# Altium schematic sheet thermokoppel.SchDoc: Soldeerstaion
size A4; DocumentNumber: PXLAI_20230001; SheetNumber: 1; SheetTotal: 5; Number: 2023_02_001; SheetNumber+/+SheetTotal: 1/2; SPICEModelCacheZQDSQXWO: <root> / <DocumentId>ZQDSQXWO</DocumentId> / <CacheFrame Number="0"> / <Model Name="mcp6001" Kind="CKT"> / <Text>.SUBCKT MCP6001 1 2 3 4 5 / *               | | | | | / *               | | | | Output / *               | | | Negative Supply / *               | | Positive Supply / *               | Inverting Input / *               Non-inverting Input / * / ******************************************************************************** / * Software License Agreement                                                   * / *                                                                              * / * The software supplied herewith by Microchip Technology Incorporated (the     * / * "Company") is intended and supplied to you, the Company's customer, for use  * / * soley and exclusively on Microchip products.                                 * / *                                                                              * / * The software is owned by the Company and/or its supplier, and is protected   * / * under applicable copyright laws. All rights are reserved. Any use in         * / * violation of the foregoing restrictions may subject the user to criminal     * / * sanctions under applicable laws, as well as to civil liability for the       * / * breach of the terms and conditions of this license.                          * / *                                                                              * / * THIS SOFTWARE IS PROVIDED IN AN "AS IS" CONDITION. NO WARRANTIES, WHETHER    * / * EXPRESS, IMPLIED OR STATUTORY, INCLUDING, BUT NOT LIMITED TO, IMPLIED        * / * WARRANTIES OF MERCHANTABILITY AND FITNESS FOR A PARTICULAR PURPOSE APPLY TO  * / * THIS SOFTWARE. THE COMPANY SHALL NOT, IN ANY CIRCUMSTANCES, BE LIABLE FOR    * / * SPECIAL, INCIDENTAL OR CONSEQUENTIAL DAMAGES, FOR ANY REASON WHATSOEVER.     * / ******************************************************************************** / * / * Macromodel for the MCP6001/2/4 op amp family: / *   MCP6001, MCP6001R, MCP6001U, MCP6002, MCP6004 / * / * Revision History: / *   REV A: 21-Jun-02, Created model / *   REV B: 16-Jul-02, Improved output stage / *   REV C: 03-Jan-03, Added MCP6001 / *   REV D: 19-Aug-06, Added over temperature, improved output stage, / *                     fixed overdrive recovery time / *   REV E: 27-Jul-07, Updated output impedance for better model stability w/cap load / *   REV F: 09-Jul-12, Added MCP6001R, MCP6001U / * / * Recommendations: / *   Use PSPICE (other simulators may require translation) / *   For a quick, effective design, use a combination of: data sheet / *     specs, bench testing, and simulations with this macromodel / *   For high impedance circuits, set GMIN=100F in .OPTIONS / * / * Supported: / *   Typical performance for temperature range (-40 to 125) degrees Celsius / *   DC, AC, Transient, and Noise analyses. / *   Most specs, including: offsets, DC PSRR, DC CMRR, input impedance, / *     open loop gain, voltage ranges, supply current, ... , etc. / *   Temperature effects for Ibias, Iquiescent, Iout short circuit / *   current, Vsat on both rails, Slew Rate vs. Temp and P.S. / * / * Not Supported: / *   Some Variation in specs vs. Power Supply Voltage / *   Monte Carlo (Vos, Ib), Process variation / *   Distortion (detailed non-linear behavior) / *   Behavior outside normal operating region / * / * Input Stage / V10  3 10 -500M / R10 10 11 6.90K / R11 10 12 6.90K / C11 11 12 0.2p / C12 1  0 6.00P / E12 71 14 POLY(4) 20 0 21 0 26 0 27 0   1.00M 20.1 20.1 1 1 / G12 1 0 62 0 1m / M12 11 14 15 15 NMI L=2.00U W=42.0U / M14 12  2 15 15 NMI L=2.00U W=42.0U / G14 2 0 62 0 1m / C14  2  0 6.00P / I15 15  4 50.0U / V16 16  4 -300M / GD16 16 1 TABLE {V(16,1)} ((-100,-1p)(0,0)(1m,1n)(2m,1m)(3m,1)) / V13  3 13 -300M / GD13 2 13 TABLE {V(2,13)} ((-100,-1p)(0,0)(1m,1n)(2m,1m)(3m,1)) / R70 1 0 20.6T / R71 2 0 20.6T / R72 1 2 20T / I80 1 2 0.5p / * / * Noise, PSRR, and CMRR / I20 21 20 423U / D20 20  0 DN1 / D21  0 21 DN1 / G26  0 26 POLY(1) 3 4   110U -49U / R26 26  0 1 / G27  0 27 POLY(2) 1 0 2 0   -440U 39.7U 39.7U / R27 27  0 1 / * / * Open Loop Gain, Slew Rate / G30  0 30 POLY(1) 12 11   0 1 / R30 30  0 1K / G31  0 31 POLY(1) 3 4 86 5.25 / R31 31  0 1 TC=2.8m / GD31 30 31 TABLE {V(30,31)} ((-11,-1)(-10,-10n)(0,0)(1m,1000)) / G32 32  0 POLY(1) 3 4 113.7 3.5 / R32 32  0 1 TC=2.65m / GD32 30 32 TABLE {V(30,32)} ((-1m,-1000)(0,0)(10,10n)(11,1)) / G33 0 33 30 0 1m / R33 33 0 1k / G34  0 34 33 0 425M / R34  34 0 1K / C34  34 0 74U / G37  0 37 34 0 1m / R37  37 0 1K / C37  37 0 41.6P / G38  0 38 37 0 1m / R38  39 0 1K / L38  38 39 100U / E38  35 0 38 0 1 / G35 33 0 TABLE {V(35,3)} ((-1,-1n)(0,0)(16,1n))(16.1,1)) / G36 33 0 TABLE {V(35,4)} ((-16.1,-1)((-16,-1n)(0,0)(1,1n)) / * / * Output Stage / R80 50 0 100MEG / G50 0 50 57 96 2 / R58 57  96 0.50 / R57 57  0 750 / C58  5  0 2.00P / G57  0 57 POLY(3) 3 0 4 0 35 0   0 0.67M 0.67M 1.5M / GD55 55 57 TABLE {V(55,57)} ((-2m,-1)(-1m,-1m)(0,0)(10,1n)) / GD56 57 56 TABLE {V(57,56)} ((-2m,-1)(-1m,-1m)(0,0)(10,1n)) / E55 55  0 POLY(2) 3 0 51 0 -0.7m 1 -40.0M / E56 56  0 POLY(2) 4 0 52 0 1.2m 1 -37.0M / R51 51 0 1k / R52 52 0 1k / GD51 50 51 TABLE {V(50,51)} ((-10,-1n)(0,0)(1m,1m)(2m,1)) / GD52 50 52 TABLE {V(50,52)} ((-2m,-1)(-1m,-1m)(0,0)(10,1n)) / G53  3  0 POLY(1) 51 0  -49U 1M / G54  0  4 POLY(1) 52 0  -49U -1M / * / * Current Limit / G99 96 5 99 0 1 / R98 0 98 1 TC=-2.8M,2.63U / G97 0 98 TABLE { V(96,5) } ((-11.0,-10.0M)(-1.00M,-9.9M)(0,0)(1.00M,9.9M)(11.0,10.0M)) / E97 99 0 VALUE { V(98)*((V(3)-V(4))*359M + 310M)} / D98 4 5 DESD / D99 5 3 DESD / * / * Temperature / Voltage Sensitive IQuiscent / R61 0 61 100 TC 3.11M 4.51U / G61 3 4 61 0 1 / G60 0 61 TABLE {V(3, 4)} / + ((0,0)(900M,0.0106U)(1.00,0.20U)(1.3,0.63U) / + (1.5,0.66U)(1.6,1.06U)(5.5,1.10U)) / * / * Temp Sensitive offset voltage / I73 0 70 DC 1uA / R74 0 70 1 TC=2 / E75 1 71 70 0 1 / * / * Temp Sensistive IBias / I62 0 62 DC 1uA / R62 0 62 REXP 58.2u / * Voltage on R62 used for G12, G14 in input stage / * / * Models / .MODEL NMI NMOS / .MODEL DESD  D   N=1 IS=1.00E-15 / .MODEL DL  D   N=1 IS=1F / .MODEL DN1 D   IS=1P KF=146E-18 AF=1 / .MODEL REXP RES TCE=10.1 / .ENDS MCP6001</Text> / </Model> / </CacheFrame> / </root>
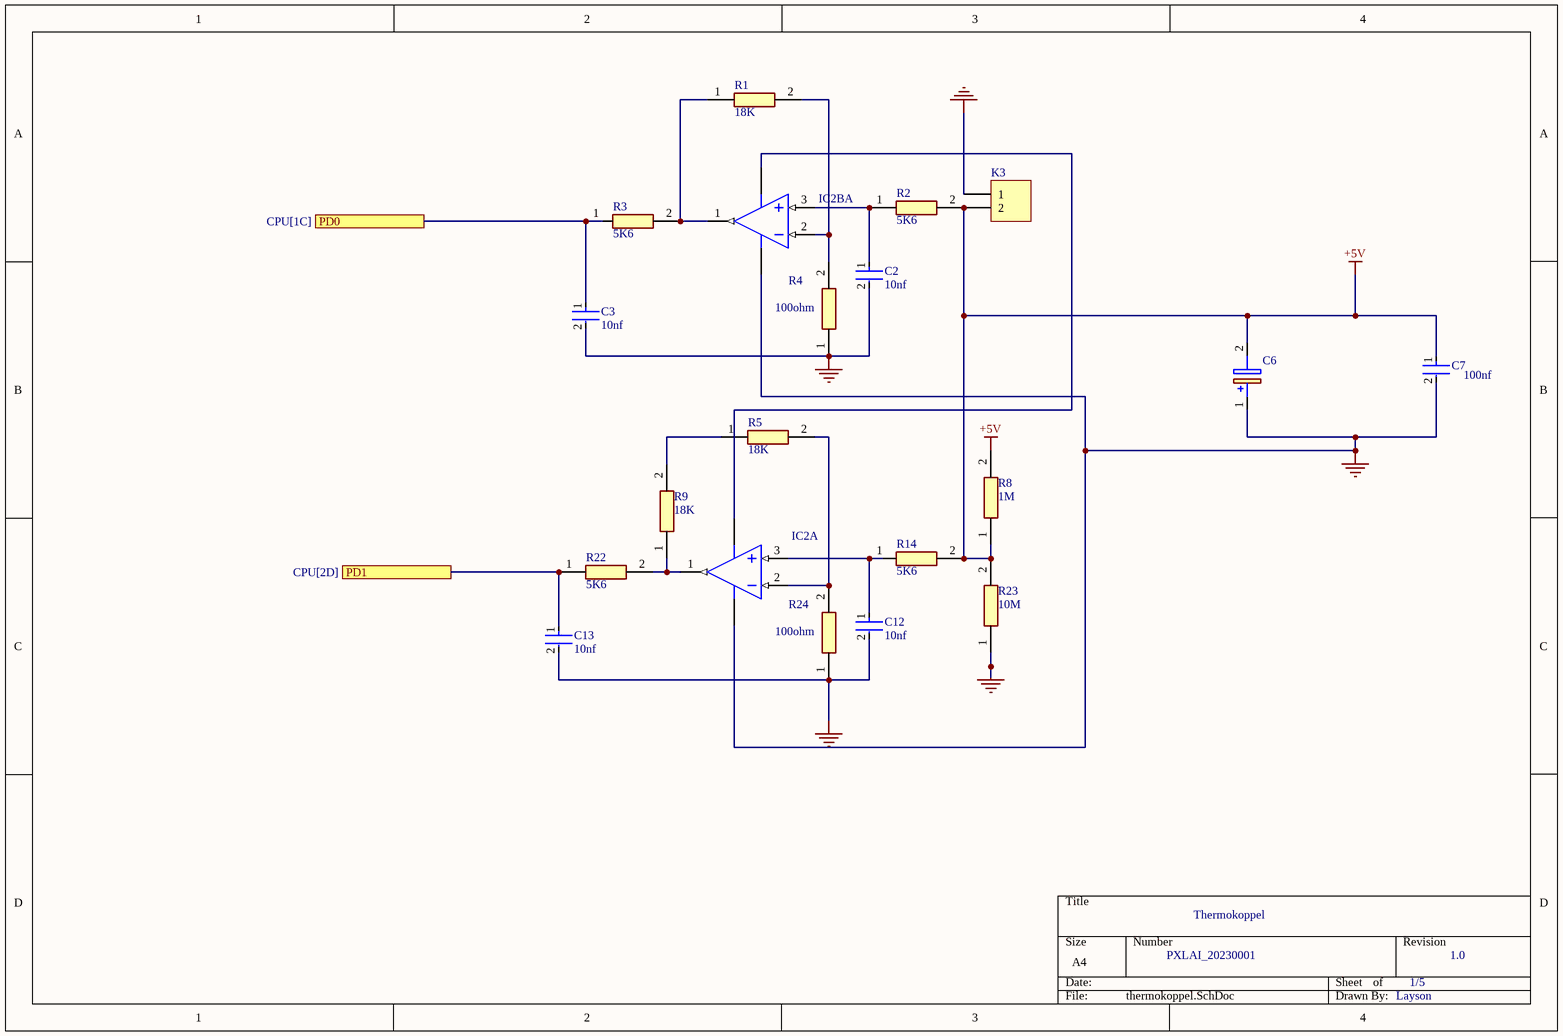
[diagram p0: thermokoppel.SchDoc]

## Parts
C2  10nf  [FP-RDE0M1-MFG]
C3  10nf  [FP-RDE0M1-MFG]
C6  MCGPR50V106M5X11  [CAPPRD200W52D525H1200]  (value not drawn)
C7  100nf  [FP-C0402-BB-MFG]
C12  10nf  [FP-RDE0M1-MFG]
C13  10nf  [FP-RDE0M1-MFG]
IC2  IC2A  [SOIC-SN8_M]  (value not drawn)  (part A of 2)
IC2B  MCP6002-E/MS  [MSOP-MS8_M]  (value not drawn)  (part A of 2)
K3  Header 2  [HDR1X2]  (value not drawn)
R1  18K  [RESC2012X65N]
R2  5K6  [RESC2012X65N]
R3  5K6  [RESC2012X65N]
R4  100ohm  [RESC2012X60N]
R5  18K  [RESC2012X65N]
R8  1M  [RESC2012X65N]
R9  18K  [RESC2012X65N]
R14  5K6  [RESC2012X65N]
R22  5K6  [RESC2012X65N]
R23  10M  [RESC2013X65N]
R24  100ohm  [RESC2012X60N]

## Ports
PD0 (see CPU[1C]), PD1 (see CPU[2D])

## Nets
+5V: C6.2(-) C7.1 K3.2 R2.2 R8.1 R8.2 R14.2 R23.2
GND: C2.2 C3.2 C6.1(+) C7.2 C12.2 C13.2 IC2.8(VDD) IC2B.8(VDD) K3.1 R4.1 R23.1 R24.1
PD0: C3.1 R3.1 ; port PD0
PD1: C13.1 R22.1 ; port PD1
NetC2_1: C2.1 IC2B.3(VINA+) R2.1
NetC12_1: C12.1 IC2.3(VINA+) R14.1
NetIC2_1: IC2.1(VOUTA) R9.1 R22.2
NetIC2_2: IC2.2(VINA-) R5.2 R24.2
NetIC2_4: IC2.4(VSS) IC2B.4(VSS)
NetIC2B_1: IC2B.1(VOUTA) R1.1 R3.2
NetIC2B_2: IC2B.2(VINA-) R1.2 R4.2
NetR5_1: R5.1 R9.2

## Notes on the sheet
- Thermokoppel
- PXLAI_20230001
- 1/5
- 1.0
- Layson

## Library data of the parts
C2 C3 C12 C13 = CMP-06035-022384-1: Ceramic Capacitor 10nF ±10% 50V X7R Radial; Lead Diameter: 0.5mm; Lead/Base Style: Kinked; Packaging: Tape and Reel; Min Operating Temperature: -55°C; Height: 3.5mm; Package Quantity: 2000; Capacitance: 10nF; Termination: Radial; Resistor Type: Ceramic; Max Operating Temperature: 125°C; Height - Seated (Max): 0.236inch; Mount: Through Hole; Length: 0.157inch; Case/Package: Radial; Voltage Rating (DC): 50V; Tolerance: 10%; Width: 3.5mm; Dielectric: X7R; Lead Free: Lead Free; Voltage Rating: 50V; Lead Pitch: 0.197inch
C6 = MCGPR50V106M5X11: Capacitor Polarised; Manufacturer_Name: MULTICOMP; Datasheet Link: https://www.farnell.com/datasheets/2861351.pdf; Height: 12mm; Manufacturer_Part_Number: MCGPR50V106M5X11
C7 = CMP-2008-02046-2: CAP CER 0.1UF 10V X5R 0402; Manufacturer: Kemet; Manufacturer Part Number: C0402C104K8PACTU; Material: Ceramic; Capacitance: 0.10 μF; Temperature Coefficient: 15%; Tolerance: 0.1; Value: 0.10 μF; Package: C0402-BB; Temperature: -55°C to +125°C; ComponentLink2Description: Datasheet; Temperature Characteristic: X5R; Device Class L1: Passive Components; Height: 0.55mm; Lead Free: Yes; ComponentLink2URL: https://content.kemet.com/datasheets/KEM_C1002_X7R_SMD.pdf; Device Class L2: Capacitors; Temperature Range Low: -55°C; Temperature Range High: +125°C; RoHS: TRUE; Octopart: https://octopart.com/c0402c104k8pactu-kemet-140039; Automotive: No; Mouser Description: Capacitor 100 nF 10 VDC 0402; Category: Cap; Voltage Rating: 10 V; Digikey Description: CAP CER 0.1UF 10V X5R 0402; Ipc Land Pattern Name: CAPC10050X50; Device Class L3: Ceramic Capacitors
IC2 = CMP-0187-00365-3: None; Bandwidth: 1MHz; Number of Elements: 2; Power Supply Rejection Ratio (PSRR): 86dB; Nominal Supply Current: 100uA; Max Supply Voltage: 6V; Input Offset Voltage-Max: 4.5mV; Voltage Gain: 112dB; Input Bias Current: 1pA; Min Supply Voltage: 1.8V; Slew Rate: 0.6V/µs; Operating Supply Voltage: 5.5V; Amplifier Type: GENERAL PURPOSE; Output Current: 23mA; Common Mode Rejection Ratio: 60dB; Gain Bandwidth Product: 1MHz; Min Operating Temperature: -40°C; Supply Current: 100uA; Number of Circuits: 2; Package Quantity: 100; Width: 3.9mm; Technology: CMOS; RoHS Compliant: Yes; Radiation Hardening: No; Mount: Surface Mount; Number of Pins: 8; Length: 4.9mm; Case/Package: SOIC; Number of Channels: 2; Max Operating Temperature: 85°C; Unity Gain Bandwidth Product: 1MHz; Lead Free: Lead Free; Number of Amplifiers: 2; REACH SVHC: No SVHC; Slew Rate-Nom: 0.6V/µs; Height: 1.25mm; Input Offset Voltage (Vos): 4.5mV; Packaging: Rail/Tube
IC2B = CMP-0187-00576-3: None; Nominal Supply Current: 100uA; Max Supply Voltage: 6V; Amplifier Type: GENERAL PURPOSE; Output Current: 23mA; Gain Bandwidth Product: 1MHz; Number of Channels: 2; Power Supply Rejection Ratio (PSRR): 86dB; Min Supply Voltage: 1.8V; Input Bias Current: 1pA; Input Offset Voltage (Vos): 4.5mV; Operating Supply Voltage: 5.5V; Slew Rate-Nom: 0.6V/µs; Common Mode Rejection Ratio: 60dB; Voltage Gain: 112dB; Mount: Surface Mount; Case/Package: MSOP; Lead Free: Lead Free; Width: 3mm; Radiation Hardening: No; Technology: CMOS; Number of Pins: 8; Supply Current: 100uA; Height: 0.95mm; Number of Elements: 2; Min Operating Temperature: -40°C; Package Quantity: 100; Packaging: Rail/Tube; Max Operating Temperature: 125°C; Slew Rate: 0.6V/µs; RoHS Compliant: Yes; Input Offset Voltage-Max: 4.5mV; Number of Amplifiers: 2; Length: 3mm; Unity Gain Bandwidth Product: 1MHz; REACH SVHC: No SVHC; Bandwidth: 1MHz; Number of Circuits: 2
K3 = Header 2: Header, 2-Pin; LatestRevisionDate: 17-Jul-2002; LatestRevisionNote: Re-released for DXP Platform.; Publisher: Altium Limited
R1 R5 R9 = CPF0805B18KE: Resistor / CPF0805B18KE; Manufacturer_Name: TE Connectivity; Datasheet Link: http://docs-europe.electrocomponents.com/webdocs/13d1/0900766b813d116f.pdf; Height: 0.65mm; Manufacturer_Part_Number: CPF0805B18KE; Mouser Part Number: 279-CPF0805B18KE; Mouser Price/Stock: https://www.mouser.co.uk/ProductDetail/TE-Connectivity-Holsworthy/CPF0805B18KE?qs=n4i9pByFsMSbsKVdiEjiPQ%3D%3D
R2 R3 R14 R22 = CPF0805B5K62E: Resistor / CPF0805B5K62E; Manufacturer_Name: TE Connectivity; Datasheet Link: http://docs-europe.electrocomponents.com/webdocs/13d1/0900766b813d116f.pdf; Height: 0.65mm; Manufacturer_Part_Number: CPF0805B5K62E; Mouser Part Number: N/A; Mouser Price/Stock: https://www.mouser.co.uk/ProductDetail/TE-Connectivity-Neohm/CPF0805B5K62E?qs=chTDxNqvsymj08Hx%252BA1%2F9A%3D%3D
R4 R24 = CR0805-JW-101ELF: Resistor / CR0805-JW-101ELF; Manufacturer_Name: Bourns; Datasheet Link: https://www.bourns.com/pdfs/chpreztr.pdf; Height: 0.6mm; Manufacturer_Part_Number: CR0805-JW-101ELF; Mouser Part Number: 652-CR0805JW-101ELF; Mouser Price/Stock: https://www.mouser.co.uk/ProductDetail/Bourns/CR0805-JW-101ELF?qs=wL7NMIHXUPl5EcPQbx1sug%3D%3D; Arrow Part Number: CR0805-JW-101ELF; Arrow Price/Stock: https://www.arrow.com/en/products/cr0805-jw-101elf/bourns?region=nac
R8 = CPF0805B1M0E: Resistor / CPF0805B1M0E; Manufacturer_Name: TE Connectivity; Datasheet Link: http://docs-europe.electrocomponents.com/webdocs/13d1/0900766b813d116f.pdf; Height: 0.65mm; Manufacturer_Part_Number: CPF0805B1M0E; Mouser Part Number: N/A; Mouser Price/Stock: https://www.mouser.com/Search/Refine.aspx?Keyword=N%2FA
R23 = CRGH0805J10M: Resistor / CRGH0805J10M; Manufacturer_Name: TE Connectivity; Datasheet Link: http://docs-europe.electrocomponents.com/webdocs/12d7/0900766b812d7379.pdf; Height: 0.65mm; Manufacturer_Part_Number: CRGH0805J10M; Mouser Part Number: 279-CRGH0805J10M; Mouser Price/Stock: https://www.mouser.co.uk/ProductDetail/TE-Connectivity-Holsworthy/CRGH0805J10M?qs=s1WWODT2SXVlIm5RdQkQ6A%3D%3D